# Altium schematic sheet LED_Indicator_controller.SchDoc
size A4; SheetNumber: 1; SheetTotal: 1
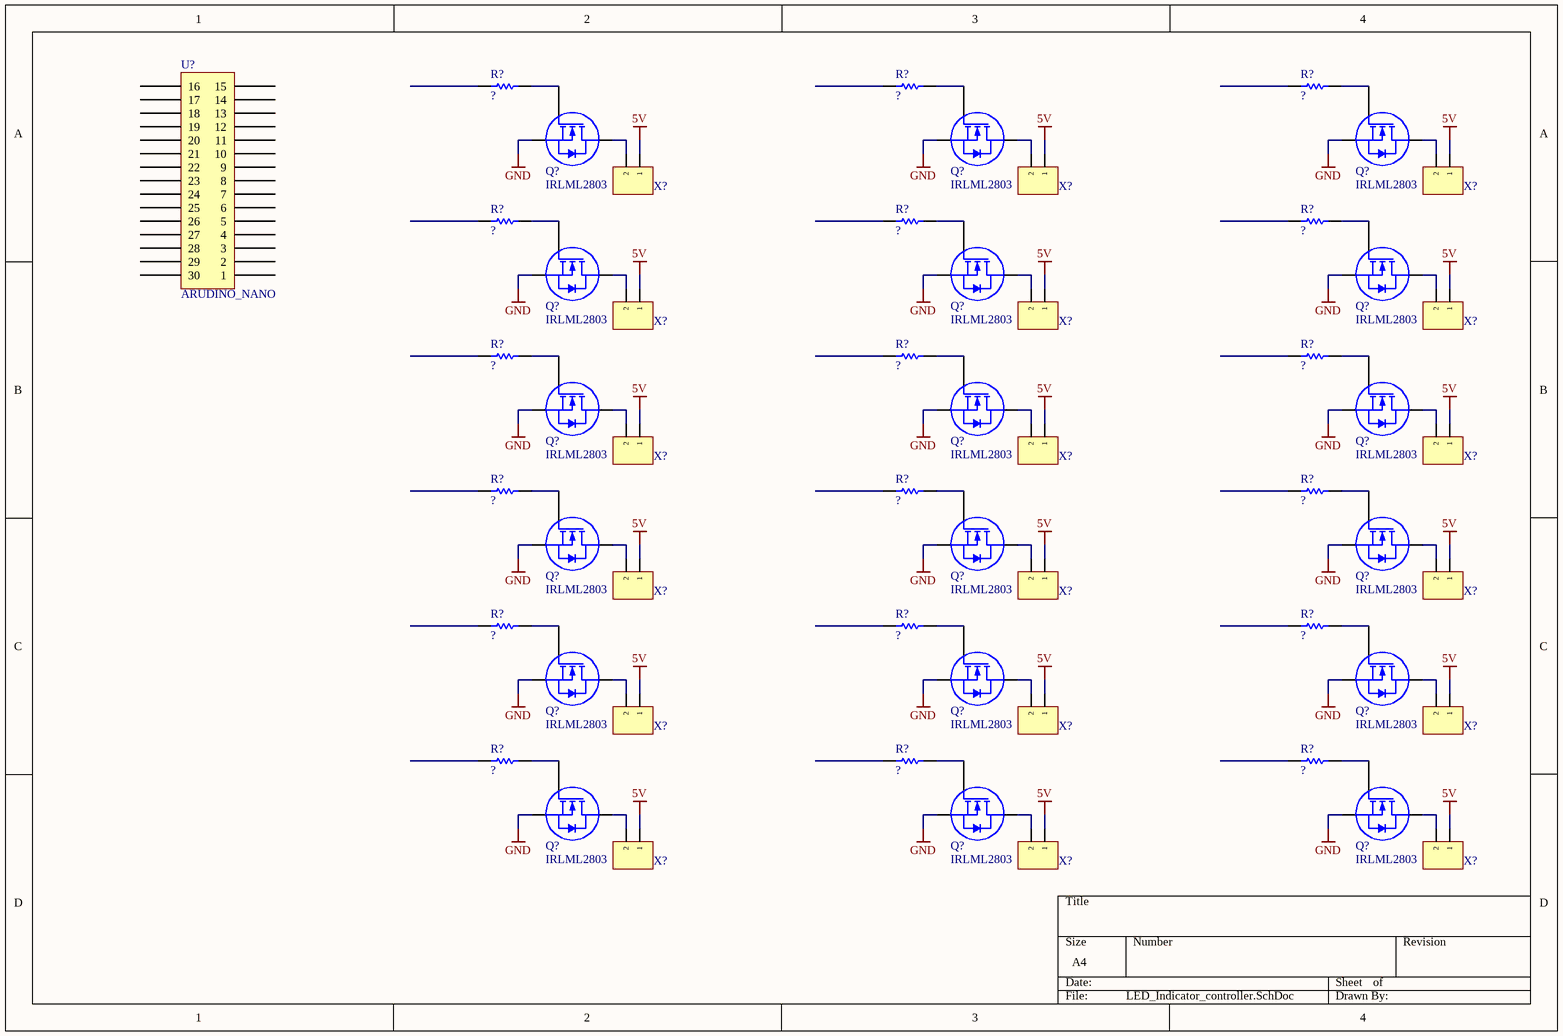
[diagram p0: LED_Indicator_controller.SchDoc]

## Parts
(Parts that share a designator on the sheet are numbered #1, #2 ... from top to bottom, then left to right.)
Q?#1  IRLML2803  [SOT23_3_PIN]
Q?#2  IRLML2803  [SOT23_3_PIN]
Q?#3  IRLML2803  [SOT23_3_PIN]
Q?#4  IRLML2803  [SOT23_3_PIN]
Q?#5  IRLML2803  [SOT23_3_PIN]
Q?#6  IRLML2803  [SOT23_3_PIN]
Q?#7  IRLML2803  [SOT23_3_PIN]
Q?#8  IRLML2803  [SOT23_3_PIN]
Q?#9  IRLML2803  [SOT23_3_PIN]
Q?#10  IRLML2803  [SOT23_3_PIN]
Q?#11  IRLML2803  [SOT23_3_PIN]
Q?#12  IRLML2803  [SOT23_3_PIN]
Q?#13  IRLML2803  [SOT23_3_PIN]
Q?#14  IRLML2803  [SOT23_3_PIN]
Q?#15  IRLML2803  [SOT23_3_PIN]
Q?#16  IRLML2803  [SOT23_3_PIN]
Q?#17  IRLML2803  [SOT23_3_PIN]
Q?#18  IRLML2803  [SOT23_3_PIN]
R?#1  Resistor  [RES_1206]  (value not drawn)
R?#2  Resistor  [RES_1206]  (value not drawn)
R?#3  Resistor  [RES_1206]  (value not drawn)
R?#4  Resistor  [RES_1206]  (value not drawn)
R?#5  Resistor  [RES_1206]  (value not drawn)
R?#6  Resistor  [RES_1206]  (value not drawn)
R?#7  Resistor  [RES_1206]  (value not drawn)
R?#8  Resistor  [RES_1206]  (value not drawn)
R?#9  Resistor  [RES_1206]  (value not drawn)
R?#10  Resistor  [RES_1206]  (value not drawn)
R?#11  Resistor  [RES_1206]  (value not drawn)
R?#12  Resistor  [RES_1206]  (value not drawn)
R?#13  Resistor  [RES_1206]  (value not drawn)
R?#14  Resistor  [RES_1206]  (value not drawn)
R?#15  Resistor  [RES_1206]  (value not drawn)
R?#16  Resistor  [RES_1206]  (value not drawn)
R?#17  Resistor  [RES_1206]  (value not drawn)
R?#18  Resistor  [RES_1206]  (value not drawn)
U?  ARUDINO_NANO  [ARDUIONO_NANO]
X?#1  HEADER_X2  [HEADER_1X2_F]  (value not drawn)
X?#2  HEADER_X2  [HEADER_1X2_F]  (value not drawn)
X?#3  HEADER_X2  [HEADER_1X2_F]  (value not drawn)
X?#4  HEADER_X2  [HEADER_1X2_F]  (value not drawn)
X?#5  HEADER_X2  [HEADER_1X2_F]  (value not drawn)
X?#6  HEADER_X2  [HEADER_1X2_F]  (value not drawn)
X?#7  HEADER_X2  [HEADER_1X2_F]  (value not drawn)
X?#8  HEADER_X2  [HEADER_1X2_F]  (value not drawn)
X?#9  HEADER_X2  [HEADER_1X2_F]  (value not drawn)
X?#10  HEADER_X2  [HEADER_1X2_F]  (value not drawn)
X?#11  HEADER_X2  [HEADER_1X2_F]  (value not drawn)
X?#12  HEADER_X2  [HEADER_1X2_F]  (value not drawn)
X?#13  HEADER_X2  [HEADER_1X2_F]  (value not drawn)
X?#14  HEADER_X2  [HEADER_1X2_F]  (value not drawn)
X?#15  HEADER_X2  [HEADER_1X2_F]  (value not drawn)
X?#16  HEADER_X2  [HEADER_1X2_F]  (value not drawn)
X?#17  HEADER_X2  [HEADER_1X2_F]  (value not drawn)
X?#18  HEADER_X2  [HEADER_1X2_F]  (value not drawn)

## Nets
5V: X?#1.1 X?#2.1 X?#3.1 X?#4.1 X?#5.1 X?#6.1 X?#7.1 X?#8.1 X?#9.1 X?#10.1 X?#11.1 X?#12.1 X?#13.1 X?#14.1 X?#15.1 X?#16.1 X?#17.1 X?#18.1
GND: Q?#1.2(S) Q?#2.2(S) Q?#3.2(S) Q?#4.2(S) Q?#5.2(S) Q?#6.2(S) Q?#7.2(S) Q?#8.2(S) Q?#9.2(S) Q?#10.2(S) Q?#11.2(S) Q?#12.2(S) Q?#13.2(S) Q?#14.2(S) Q?#15.2(S) Q?#16.2(S) Q?#17.2(S) Q?#18.2(S)
NetQ?#1_1: Q?#1.1(G) R?#1.2
NetQ?#1_3: Q?#1.3(D) X?#1.2
NetQ?#2_1: Q?#2.1(G) R?#2.2
NetQ?#2_3: Q?#2.3(D) X?#2.2
NetQ?#3_1: Q?#3.1(G) R?#3.2
NetQ?#3_3: Q?#3.3(D) X?#3.2
NetQ?#4_1: Q?#4.1(G) R?#4.2
NetQ?#4_3: Q?#4.3(D) X?#4.2
NetQ?#5_1: Q?#5.1(G) R?#5.2
NetQ?#5_3: Q?#5.3(D) X?#5.2
NetQ?#6_1: Q?#6.1(G) R?#6.2
NetQ?#6_3: Q?#6.3(D) X?#6.2
NetQ?#7_1: Q?#7.1(G) R?#7.2
NetQ?#7_3: Q?#7.3(D) X?#7.2
NetQ?#8_1: Q?#8.1(G) R?#8.2
NetQ?#8_3: Q?#8.3(D) X?#8.2
NetQ?#9_1: Q?#9.1(G) R?#9.2
NetQ?#9_3: Q?#9.3(D) X?#9.2
NetQ?#10_1: Q?#10.1(G) R?#10.2
NetQ?#10_3: Q?#10.3(D) X?#10.2
NetQ?#11_1: Q?#11.1(G) R?#11.2
NetQ?#11_3: Q?#11.3(D) X?#11.2
NetQ?#12_1: Q?#12.1(G) R?#12.2
NetQ?#12_3: Q?#12.3(D) X?#12.2
NetQ?#13_1: Q?#13.1(G) R?#13.2
NetQ?#13_3: Q?#13.3(D) X?#13.2
NetQ?#14_1: Q?#14.1(G) R?#14.2
NetQ?#14_3: Q?#14.3(D) X?#14.2
NetQ?#15_1: Q?#15.1(G) R?#15.2
NetQ?#15_3: Q?#15.3(D) X?#15.2
NetQ?#16_1: Q?#16.1(G) R?#16.2
NetQ?#16_3: Q?#16.3(D) X?#16.2
NetQ?#17_1: Q?#17.1(G) R?#17.2
NetQ?#17_3: Q?#17.3(D) X?#17.2
NetQ?#18_1: Q?#18.1(G) R?#18.2
NetQ?#18_3: Q?#18.3(D) X?#18.2

Not connected (* = marked no-connect by the designer): R?#1 1; R?#2 1; R?#3 1; R?#4 1; R?#5 1; R?#6 1; R?#7 1; R?#8 1; R?#9 1; R?#10 1; R?#11 1; R?#12 1; R?#13 1; R?#14 1; R?#15 1; R?#16 1; R?#17 1; R?#18 1; U? 1 2 3 4 5 6 7 8 9 10 11 12 13 14 15 16 17 18 19 20 21 22 23 24 25 26 27 28 29 30

## Library data of the parts
Q?#1-Q?#18 = IRLML2803: N-MOSFET; VDSS: 30 V; RDSon: 0.25 Ohm; IDmax: 1.2 A; VGSmax: 20 V
R?#1-R?#18 = Resistor: Resistance: ?